# EAGLE design lm2574 (EAGLE 7.4.0)
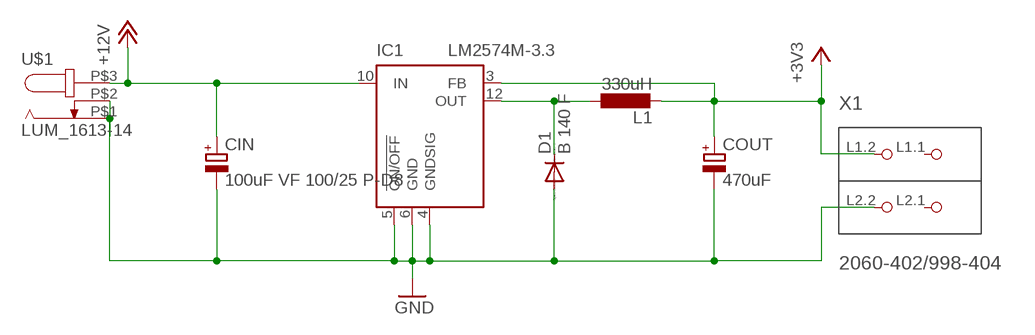
[diagram p0: schematic, sheet 1]

## Parts
CIN  100uF VF 100/25 P-D8  CPOL-EU153CLV-0605  [153CLV-0605]
COUT  470uF  CPOL-EU153CLV-0810  [153CLV-0810]
D1  B 140 F  DIODE-DO-214AC  [DO-214AC]
IC1  LM2574M-3.3  [SO14W]
L1  330uH  PIS4728  [PIS2816]
U$1  LUM_1613-14  [DCJ0202]
X1  2060-402/998-404  [P-2060-402/998-404]

## Nets
+3V3: COUT.+ IC1.3(FB) L1.2 X1.L1.2(P1.2)
+12V: CIN.+ IC1.10(IN) U$1.P$3
GND: CIN.- COUT.- D1.A IC1.4(GNDSIG) IC1.5(!ON/OFF) IC1.6(GND) U$1.P$1 U$1.P$2 X1.L2.2(P2.2)
N$3: D1.C IC1.12(OUT) L1.1
Unconnected: X1.L1.1(P1.1) X1.L2.1(P2.1)

## Library data of the parts
CIN = resistor:CPOL-EU: POLARIZED CAPACITOR, European symbol
COUT = rcl:CPOL-EU: POLARIZED CAPACITOR, European symbol
D1 = diode:DIODE-: DIODE
IC1 = linear:LM2574?-*: SIMPLE SWITCHER 0.5A Step-Down Voltage Regulator Source: http://cache.national.com/ds/LM/LM2574.pdf
L1 = jbolay:PIS4728
U$1 = jbolay:LUM_1613-14: Netzgeräte-Einbaukupplung, abgewinkelte Ausführung, mit Öffner, für Leiterplatten, Surface-Mount-Technik (SMT) Hohlstecker Reichelt Artikel-Nr.: LUM 1613-14
X1 = con-wago_2060:2060-402/998-404: Serie 2060, SMD-Leiterplattenklemme mit Betätigungsdrückern im Gurt 2-polig / Series 2060, SMD terminal block with push-buttons in tape-and-reel packing 2-pole Polzahl / Pole No.: 2 Rastermaß / Pitch: 4 mm Bemessungsspannung / Rated Voltage: 160 V Nennstrom / Nominal Current: 9 A Leiterquerschnitt / Conductor Size: 0.2 - 0.75 mm2 Anschlusstechnik / Connection Technology: CAGE CLAMP® S Leitereinführung (zur Platine) / Conductor entry angle (to PCB): 0 ° Farbe / Color: lichtgrau / light gray Stand: 01.01.2014. Die jeweils aktuellen Daten zu diesem Artikel finden Sie in unserem Produktkatalog, den Sie unter www.wago.com einsehen können. As of: 01/01/2014. Please find the newest data for this article in our product catalogue, which can be viewed under www.wago.com.

## Net classes
0 default: width 0.381 mm, clearance 0.381 mm

## Board
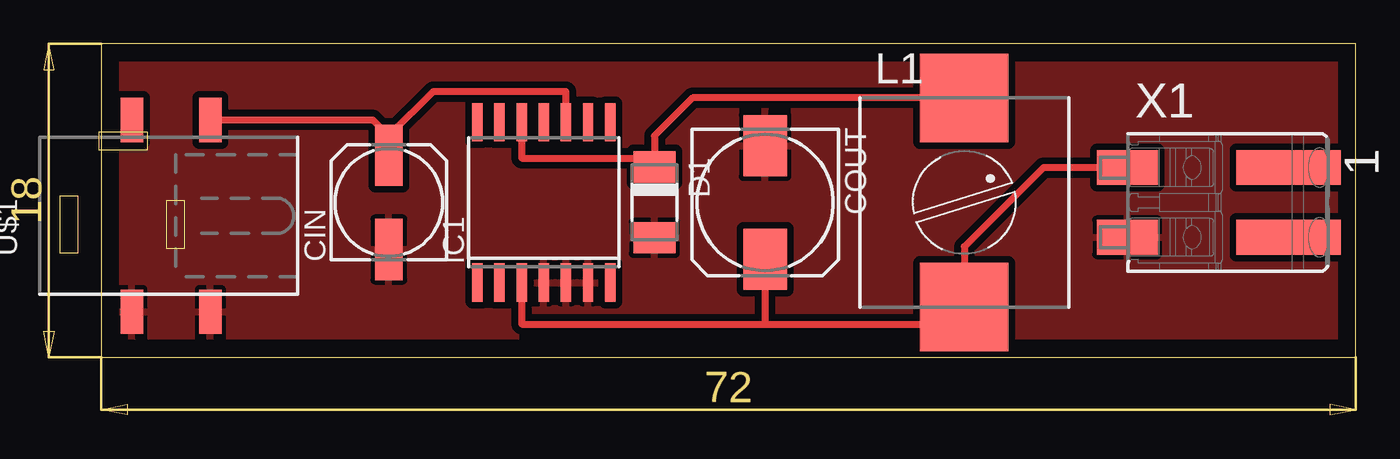
[diagram p1: board, top side]

Size 72 x 18 mm. Coordinates in mm from the lower left corner, seen from the top.
Outline: 0,0 72,0 72,18 0,18 0,0
Copper layers (1*16): Top 0.035mm / dielectric 1.5mm / Bottom 0.035mm
Design rules "default": minimum track width 10mil, minimum drill 24mil, track to track 8mil, track to pad 8mil, pad to pad 8mil, via to via 8mil, smd to smd 8mil, copper to edge 40mil, drill to drill 8mil, minimum pad ring 10mil, minimum via ring 8mil, stop-mask expansion 4mil, vias tented up to drill 0mil, thermal gap 10mil

### Footprints (pad centres in the part's own frame; a part is rotated, then mirrored left to right if it is on the bottom)
153CLV-0605 = smd 3.5 x 1.6: + 2.7,0; - -2.7,0
153CLV-0810 = smd 3.5 x 2.5: + 3.25,0; - -3.25,0
DO-214AC = smd 1.8 x 2.4: A 2.025,0; C -2.025,0
SO14W = smd 0.6 x 2.2: 1 -3.81,-4.6; 2 -2.54,-4.6; 3 -1.27,-4.6; 4 0,-4.6; 5 1.27,-4.6; 6 2.54,-4.6; 7 3.81,-4.6; 8 3.81,4.6; 9 2.54,4.6; 10 1.27,4.6; 11 0,4.6; 12 -1.27,4.6; 13 -2.54,4.6; 14 -3.81,4.6
PIS2816 = smd 5.08 x 5.08: 1 0,6; 2 0,-6
DCJ0202 = smd 2.54 x 1.27: P$1 -5,-5; P$2 -5,-0.5; P$3 6,-5; P$4 6,-0.5
P-2060-402/998-404 = smd 6 x 2: L1.1 4.625,2; L2.1 4.625,-2 | smd 3.5 x 2: L1.2 -4.625,2; L2.2 -4.625,-2

### Placement (x,y rotation side)
CIN  16.51,8.89 90 top
COUT  38.1,8.89 270 top
D1  31.75,8.89 270 top
IC1  25.4,8.89 0 top
L1  49.53,8.89 0 top
U$1  1.27,7.62 90 top
X1  63.5,8.89 0 top

### Tracks (layer width: path | path; a pad name or v marks a point on that pad's centre or on a via)
+3V3
  Top 0.406: IC1.3 24.13,1.91 38.1,1.91 | 38.1,1.91 48.9,1.91 49.53,2.54 L1.2 49.53,6.35 54.07,10.89 X1.L1.2 | COUT.+ 38.1,1.91
+12V
  Top 0.406: U$1.P$3 15.59,13.62 16.51,12.7 | IC1.10 26.67,15.24 19.05,15.24 16.51,12.7 | 16.51,11.43 CIN.+ 16.51,12.7
GND
  pour Top: 0,17.78 71.12,17.78 71,-1 0,0
N$3
  Top 0.406: IC1.12 24.13,11.43 31.23,11.43 D1.C 31.75,12.7 33.94,14.89 L1.1